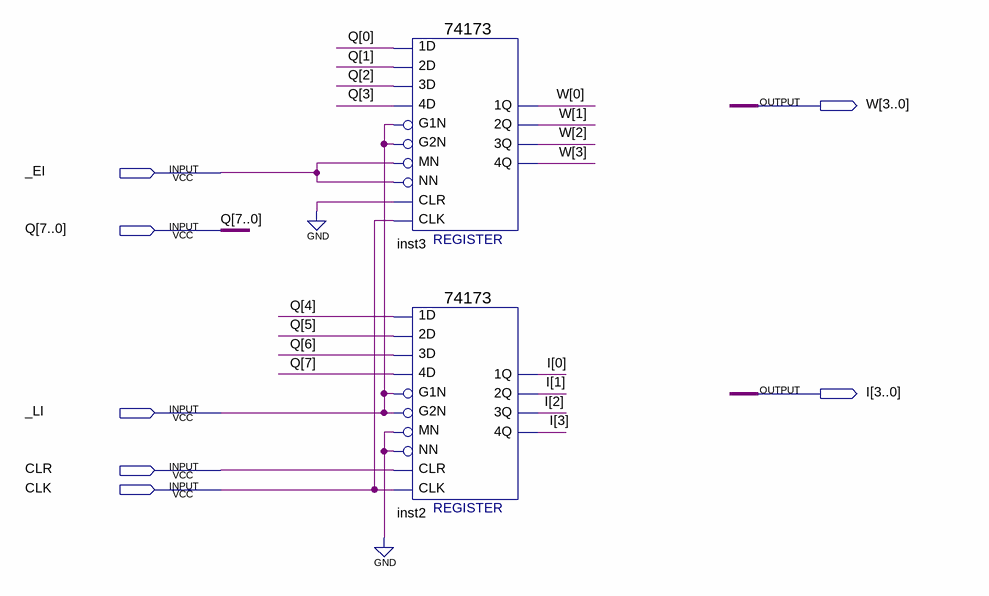
[diagram p0: schematic sheet]
// Quartus schematic Registrador_de_Instrucao.bdf as structural Verilog: 2 symbols, 7 pins
module Registrador_de_Instrucao (
  input  _EI,
  input  [7:0] Q,
  input  _LI,
  input  CLR,
  input  CLK,
  output [3:0] W,
  output [3:0] I
);

  \74173  inst3 (
    .\3D (Q[2]), .MN(_EI), .\1D (Q[0]), .\2D (Q[1]), .\4D (Q[3]), .G1N(_LI), .G2N(_LI), .NN(_EI), .CLR(1'b0),
    .CLK(CLK), .\3Q (W[2]), .\2Q (W[1]), .\1Q (W[0]), .\4Q (W[3]));
  \74173  inst2 (
    .\3D (Q[6]), .MN(1'b0), .\1D (Q[4]), .\2D (Q[5]), .\4D (Q[7]), .G1N(_LI), .G2N(_LI), .NN(1'b0),
    .CLR(CLR), .CLK(CLK), .\3Q (I[2]), .\2Q (I[1]), .\1Q (I[0]), .\4Q (I[3]));
endmodule
